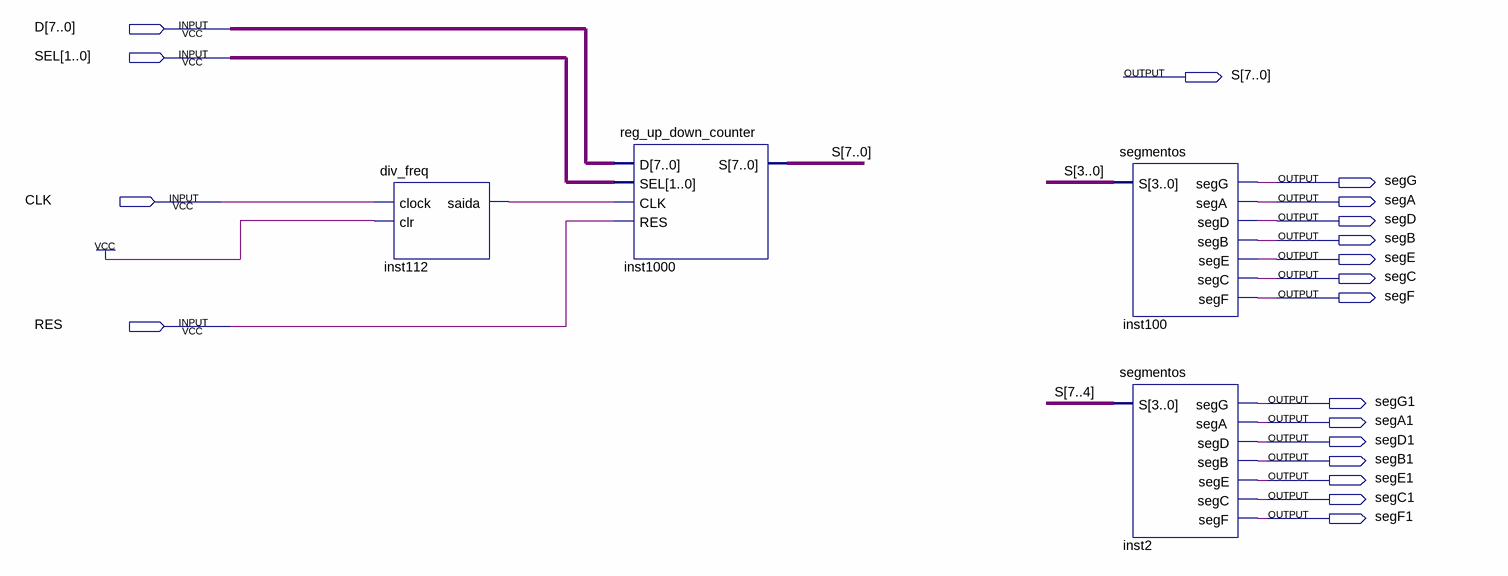
[diagram p0: schematic sheet]
// Quartus schematic lab_06_entrega.bdf as structural Verilog: 4 symbols, 19 pins
module lab_06_entrega (
  input  [7:0] D,
  input  [1:0] SEL,
  input  CLK,
  input  RES,
  output [7:0] S,
  output segG,
  output segA,
  output segD,
  output segB,
  output segE,
  output segC,
  output segF,
  output segG1,
  output segA1,
  output segD1,
  output segB1,
  output segE1,
  output segC1,
  output segF1
);

  wire inst112_saida;

  div_freq inst112 (.clock(CLK), .clr(1'b1), .saida(inst112_saida));
  reg_up_down_counter inst1000 (.D(D), .SEL(SEL), .CLK(inst112_saida), .RES(RES), .S(S));
  segmentos inst100 (
    .S(S[3:0]), .segG(segG), .segA(segA), .segD(segD), .segB(segB), .segE(segE), .segC(segC), .segF(segF));
  segmentos inst2 (
    .S(S[7:4]), .segG(segG1), .segA(segA1), .segD(segD1), .segB(segB1), .segE(segE1), .segC(segC1),
    .segF(segF1));
endmodule
